# EAGLE design AGCON (EAGLE 6.5.0)
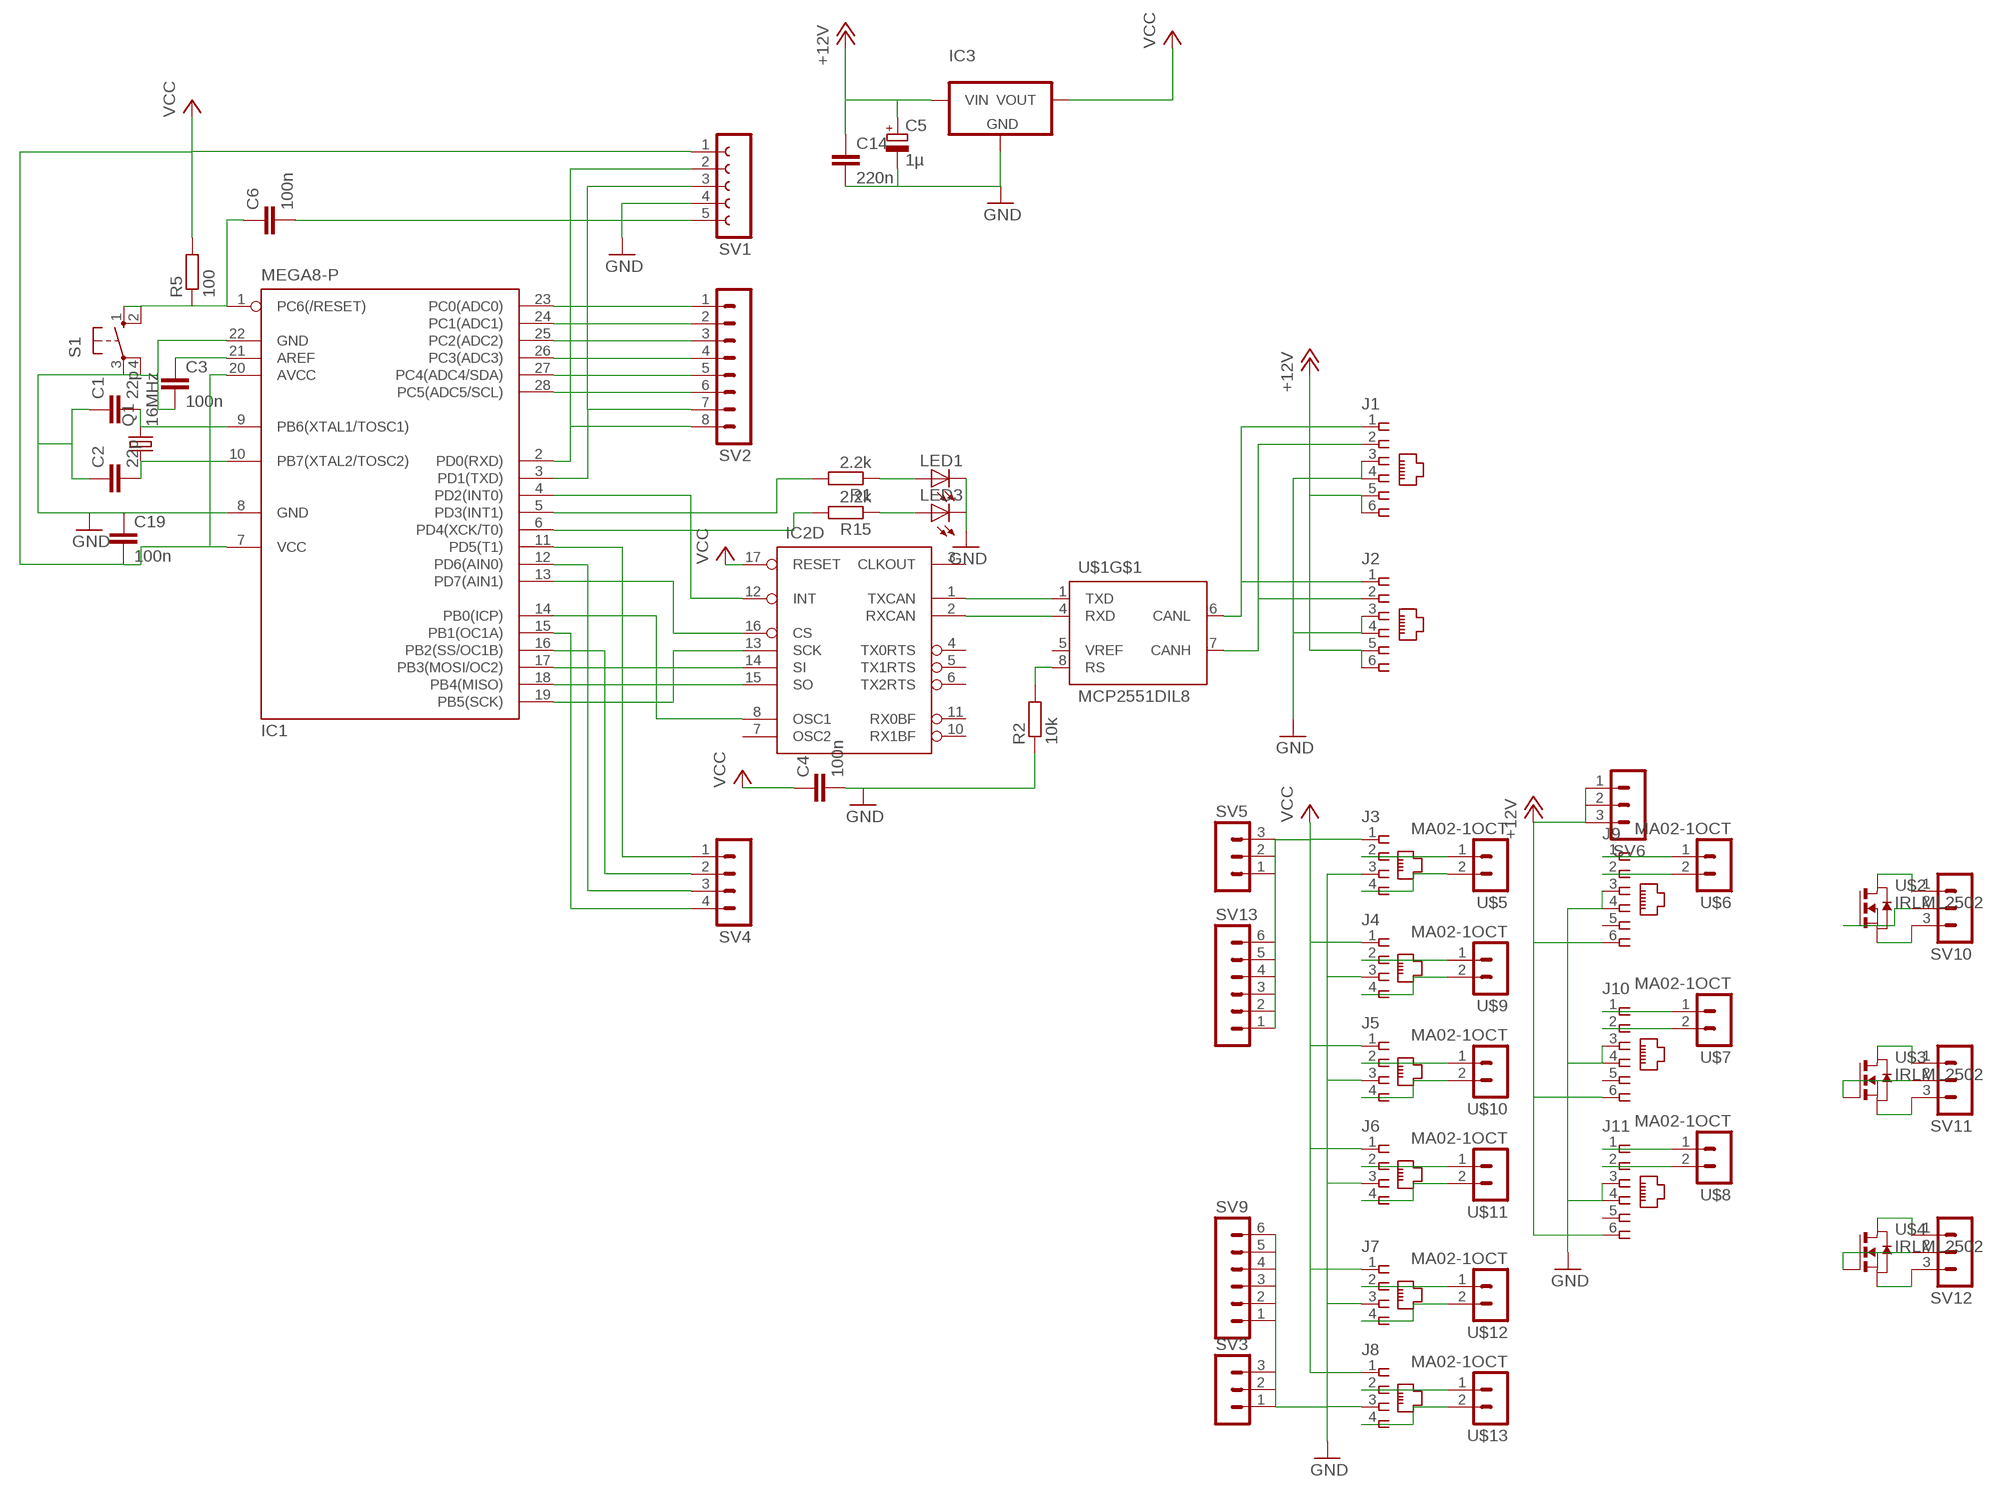
[diagram p0: schematic, sheet 1]

## Parts
C1  22p  C-EU025-024X044  [C025-024X044]
C2  22p  C-EU025-024X044  [C025-024X044]
C3  100n  C-EU050-024X044  [C050-024X044]
C4  100n  C-EU050-024X044  [C050-024X044]
C5  1µ  CPOL-EUE5-10.5  [E5-10,5]
C6  100n  C-EU050-024X044  [C050-024X044]
C14  220n  C-EU050-024X044  [C050-024X044]
C19  100n  C-EU050-024X044  [C050-024X044]
IC1  MEGA8-P  [DIL28-3]
IC2  MCP2515P  [DIL18]
IC3  MCP1702  [TO-92]
J1  520250-3  [520250-3]
J2  520250-3  [520250-3]
J3  520249-2  [520249-2]
J4  520249-2  [520249-2]
J5  520249-2  [520249-2]
J6  520249-2  [520249-2]
J7  520249-2  [520249-2]
J8  520249-2  [520249-2]
J9  520250-3  [520250-3]
J10  520250-3  [520250-3]
J11  520250-3  [520250-3]
LED1  LED3MM  [LED3MM]
LED3  LED3MM  [LED3MM]
Q1  16MHz  CRYSTALHC18U-V  [HC18U-V]
R1  2.2k  R-EU_0207/7  [0207/7]
R2  10k  R-EU_0207/7  [0207/7]
R5  100  R-EU_0207/7  [0207/7]
R15  2.2k  R-EU_0207/7  [0207/7]
S1  10-XX  [B3F-10XX]
SV1  FE05-1  [FE05-1]
SV2  MA08-1OCT  [MA08-1OCT]
SV3  MA03-1OCT  [MA03-1OCT]
SV4  MA04-1OCT  [MA04-1OCT]
SV5  MA03-1OCT  [MA03-1OCT]
SV6  MA03-1OCT  [MA03-1OCT]
SV9  MA06-1MA06-1OCT  [MA06-1OCT]
SV10  MA03-1OCT  [MA03-1OCT]
SV11  MA03-1OCT  [MA03-1OCT]
SV12  MA03-1OCT  [MA03-1OCT]
SV13  MA06-1MA06-1OCT  [MA06-1OCT]
U$1  MCP2551DIL8  [DIL08]
U$2  IRLML2502  [SOT-23]
U$3  IRLML2502  [SOT-23]
U$4  IRLML2502  [SOT-23]
U$5  MA02-1OCT  [MA02-1OCT]
U$6  MA02-1OCT  [MA02-1OCT]
U$7  MA02-1OCT  [MA02-1OCT]
U$8  MA02-1OCT  [MA02-1OCT]
U$9  MA02-1OCT  [MA02-1OCT]
U$10  MA02-1OCT  [MA02-1OCT]
U$11  MA02-1OCT  [MA02-1OCT]
U$12  MA02-1OCT  [MA02-1OCT]
U$13  MA02-1OCT  [MA02-1OCT]

## Nets
+12V: C5.+ C14.1 IC3.2(VIN) J1.5 J1.6 J2.5 J2.6 J9.6 J10.6 J11.6 SV6.1 SV6.2 SV6.3
GND: C1.1 C2.1 C3.2 C4.2 C5.- C14.2 C19.1 IC1.8(GND) IC1.22(GND) IC3.1(GND) J1.3 J1.4 J2.3 J2.4 J3.3 J4.3 J5.3 J6.3 J7.3 J8.3 J9.3 J9.4 J10.3 J10.4 J11.3 J11.4 LED1.K(C) LED3.K(C) R2.1 S1.3(P) S1.4(P1) SV1.4 SV3.1 SV3.2 SV3.3 SV9.1 SV9.2 SV9.3 SV9.4 SV9.5 SV9.6
N$1: IC1.18(PB4(MISO)) IC2.15(D:SO)
N$2: IC1.17(PB3(MOSI/OC2)) IC2.14(D:SI)
N$3: IC1.19(PB5(SCK)) IC2.13(D:SCK)
N$4: IC2.1(D:TXCAN) U$1.1(TXD)
N$5: IC2.2(D:RXCAN) U$1.4(RXD)
N$6: J1.1 J2.1 U$1.6(CANL)
N$7: J1.2 J2.2 U$1.7(CANH)
N$8: IC1.6(PD4(XCK/T0)) R15.2
N$9: C6.1 IC1.1(PC6(/RESET)) R5.1 S1.1(S) S1.2(S1)
N$10: LED1.A R1.1
N$11: C6.2 SV1.5
N$12: LED3.A R15.1
N$13: IC1.5(PD3(INT1)) R1.2
N$14: IC1.14(PB0(ICP)) IC2.8(D:OSC1)
N$15: R2.2 U$1.8(RS)
N$16: IC1.3(PD1(TXD)) SV1.3 SV2.7
N$17: IC1.2(PD0(RXD)) SV1.2 SV2.8
N$18: IC1.4(PD2(INT0)) IC2.12(D:INT)
N$19: IC1.13(PD7(AIN1)) IC2.16(D:CS)
N$20: C3.1 IC1.21(AREF)
N$21: IC1.23(PC0(ADC0)) SV2.1
N$22: C1.2 IC1.9(PB6(XTAL1/TOSC1)) Q1.2
N$23: C2.2 IC1.10(PB7(XTAL2/TOSC2)) Q1.1
N$24: IC1.24(PC1(ADC1)) SV2.2
N$25: IC1.25(PC2(ADC2)) SV2.3
N$26: IC1.26(PC3(ADC3)) SV2.4
N$27: IC1.27(PC4(ADC4/SDA)) SV2.5
N$28: IC1.28(PC5(ADC5/SCL)) SV2.6
N$29: J4.2 U$9.1
N$30: J5.2 U$10.1
N$31: IC1.11(PD5(T1)) SV4.1
N$32: IC1.12(PD6(AIN0)) SV4.3
N$33: IC1.15(PB1(OC1A)) SV4.4
N$34: IC1.16(PB2(SS/OC1B)) SV4.2
N$47: J6.2 U$11.1
N$48: J9.1 U$6.1
N$49: J9.2 U$6.2
N$50: J10.1 U$7.1
N$51: J3.2 U$5.1
N$52: J3.4 U$5.2
N$53: J10.2 U$7.2
N$54: J4.4 U$9.2
N$55: J11.1 U$8.1
N$56: J5.4 U$10.2
N$57: J11.2 U$8.2
N$58: J6.4 U$11.2
N$59: J7.2 U$12.1
N$60: J7.4 U$12.2
N$61: J8.2 U$13.1
N$62: J8.4 U$13.2
N$63: SV10.1 U$2.3(D)
N$64: SV10.2 U$2.1(G)
N$65: SV10.3 U$2.2(S)
N$66: SV11.1 U$3.3(D)
N$67: SV11.2 U$3.1(G)
N$68: SV11.3 U$3.2(S)
N$69: SV12.1 U$4.3(D)
N$70: SV12.2 U$4.1(G)
N$71: SV12.3 U$4.2(S)
VCC: C4.1 C19.2 IC1.7(VCC) IC1.20(AVCC) IC2.17(D:RESET) IC3.3(VOUT) J3.1 J4.1 J5.1 J6.1 J7.1 J8.1 R5.2 SV1.1 SV5.1 SV5.2 SV5.3 SV13.1 SV13.2 SV13.3 SV13.4 SV13.5 SV13.6
Unconnected: IC2.3(D:CLKOUT) IC2.4(D:TX0RTS) IC2.5(D:TX1RTS) IC2.6(D:TX2RTS) IC2.7(D:OSC2) IC2.10(D:RX1BF) IC2.11(D:RX0BF) J9.5 J10.5 J11.5 U$1.5(VREF)

## Power pins joined to a net without a drawn wire
GND: IC2.9(P:GND) U$1.2(GND)
VCC: IC2.18(P:VCC) U$1.3(VCC)

## Library data of the parts
C1 C2 = resistor:C-EU: CAPACITOR, European symbol
C3 C4 C6 C14 C19 = rcl:C-EU: CAPACITOR, European symbol
C5 = resistor:CPOL-EU: POLARIZED CAPACITOR, European symbol
IC1 = atmel:MEGA8-P: MICROCONTROLLER 8 Kbytes FLASH, 1 kbytes SRAM, 512 bytes EEPROM, USART, 4-channel 10 bit ADC, 2-channel 8 bit ADC Pin compatible with Atmega48, ATMega88, ATMega168 Source: avr.lbr; OC_FARNELL: unknown; OC_NEWARK: unknown
IC2 = can:MCP2515: MC2515 Stand-Alone CAN Controller With SPI Interface, Microchip
IC3 = SteveMarple:MCP1702: Microchip MCP1702 250mA loq quiescent current (2uA) LDO voltage regulator.
J1 J2 J9-J11 = con-amp:520250-3: AMP connector
J3-J8 = con-amp:520249-2: AMP connector
LED1 LED3 = led:LED: LED OSRAM: - CHIPLED LG R971, LG N971, LY N971, LG Q971, LY Q971, LO R971, LY R971 LH N974, LH R974 LS Q976, LO Q976, LY Q976 LO Q996 - Hyper CHIPLED LW Q18S LB Q993, LB Q99A, LB R99A - SideLED LS A670, LO A670, LY A670, LG A670, LP A670 LB A673, LV A673, LT A673, LW A673 LH A674 LY A675 LS A676, LA A676, LO A676, LY A676, LW A676 LS A679, LY A679, LG A679 - Hyper Micro SIDELED® LS Y876, LA Y876, LO Y876, LY Y876 LT Y87S - SmartLED LW L88C, LW L88S LB L89C, LB L89S, LG L890 LS L89K, LO L89K, LY L89K LS L896, LA L896, LO L896, LY L896 - TOPLED LS T670, LO T670, LY T670, LG T670, LP T670 LSG T670, LSP T670, LSY T670, LOP T670, LYG T670 LG T671, LOG T671, LSG T671 LB T673, LV T673, LT T673, LW T673 LH T674 LS T676, LA T676, LO T676, LY T676, LB T676, LH T676, LSB T676, LW T676 LB T67C, LV T67C, LT T67C, LS T67K, LO T67K, LY T67K, LW E67C LS E67B, LA E67B, LO E67B, LY E67B, LB E67C, LV E67C, LT E67C LW T67C LS T679, LY T679, LG T679 LS T770, LO T770, LY T770, LG T770, LP T770 LB T773, LV T773, LT T773, LW T773 LH T774 LS E675, LA E675, LY E675, LS T675 LS T776, LA T776, LO T776, LY T776, LB T776 LHGB T686 LT T68C, LB T68C - Hyper Mini TOPLED® LB M676 - Mini TOPLED Santana® LG M470 LS M47K, LO M47K, LY M47K Source: http://www.osram.convergy.de LUXEON: - LUMILED® LXK2-PW12-R00, LXK2-PW12-S00, LXK2-PW14-U00, LXK2-PW14-V00 LXK2-PM12-R00, LXK2-PM12-S00, LXK2-PM14-U00 LXK2-PE12-Q00, LXK2-PE12-R00, LXK2-PE12-S00, LXK2-PE14-T00, LXK2-PE14-U00 LXK2-PB12-K00, LXK2-PB12-L00, LXK2-PB12-M00, LXK2-PB14-N00, LXK2-PB14-P00, LXK2-PB14-Q00 LXK2-PR12-L00, LXK2-PR12-M00, LXK2-PR14-Q00, LXK2-PR14-R00 LXK2-PD12-Q00, LXK2-PD12-R00, LXK2-PD12-S00 LXK2-PH12-R00, LXK2-PH12-S00 LXK2-PL12-P00, LXK2-PL12-Q00, LXK2-PL12-R00 Source: www.luxeon.com KINGBRIGHT: KA-3528ASYC Source: www.kingbright.com
Q1 = crystal:CRYSTAL: CRYSTAL; OC_FARNELL: unknown; OC_NEWARK: unknown
R1 R2 R5 R15 = resistor:R-EU_: RESISTOR, European symbol
S1 = switch-omron:10-XX: OMRON SWITCH; MPN: B3F-1000; OC_FARNELL: 176432; OC_NEWARK: 36M3542
SV1 = con-lsta:FE05-1: FEMALE HEADER; OC_FARNELL: unknown; OC_NEWARK: unknown
SV2 = con-lstb:MA08-1: PIN HEADER
SV3 SV5 SV6 SV10-SV12 = con-lstb:MA03-1: PIN HEADER
SV4 = con-lstb:MA04-1: PIN HEADER
SV9 SV13 = con-lstb:MA06-1: PIN HEADER
U$1 = can:MCP2551: CAN Tranceiver Microchip
U$2-U$4 = IRLML2502:IRLML2502
U$5-U$13 = con-lstb:MA02-1

## Board
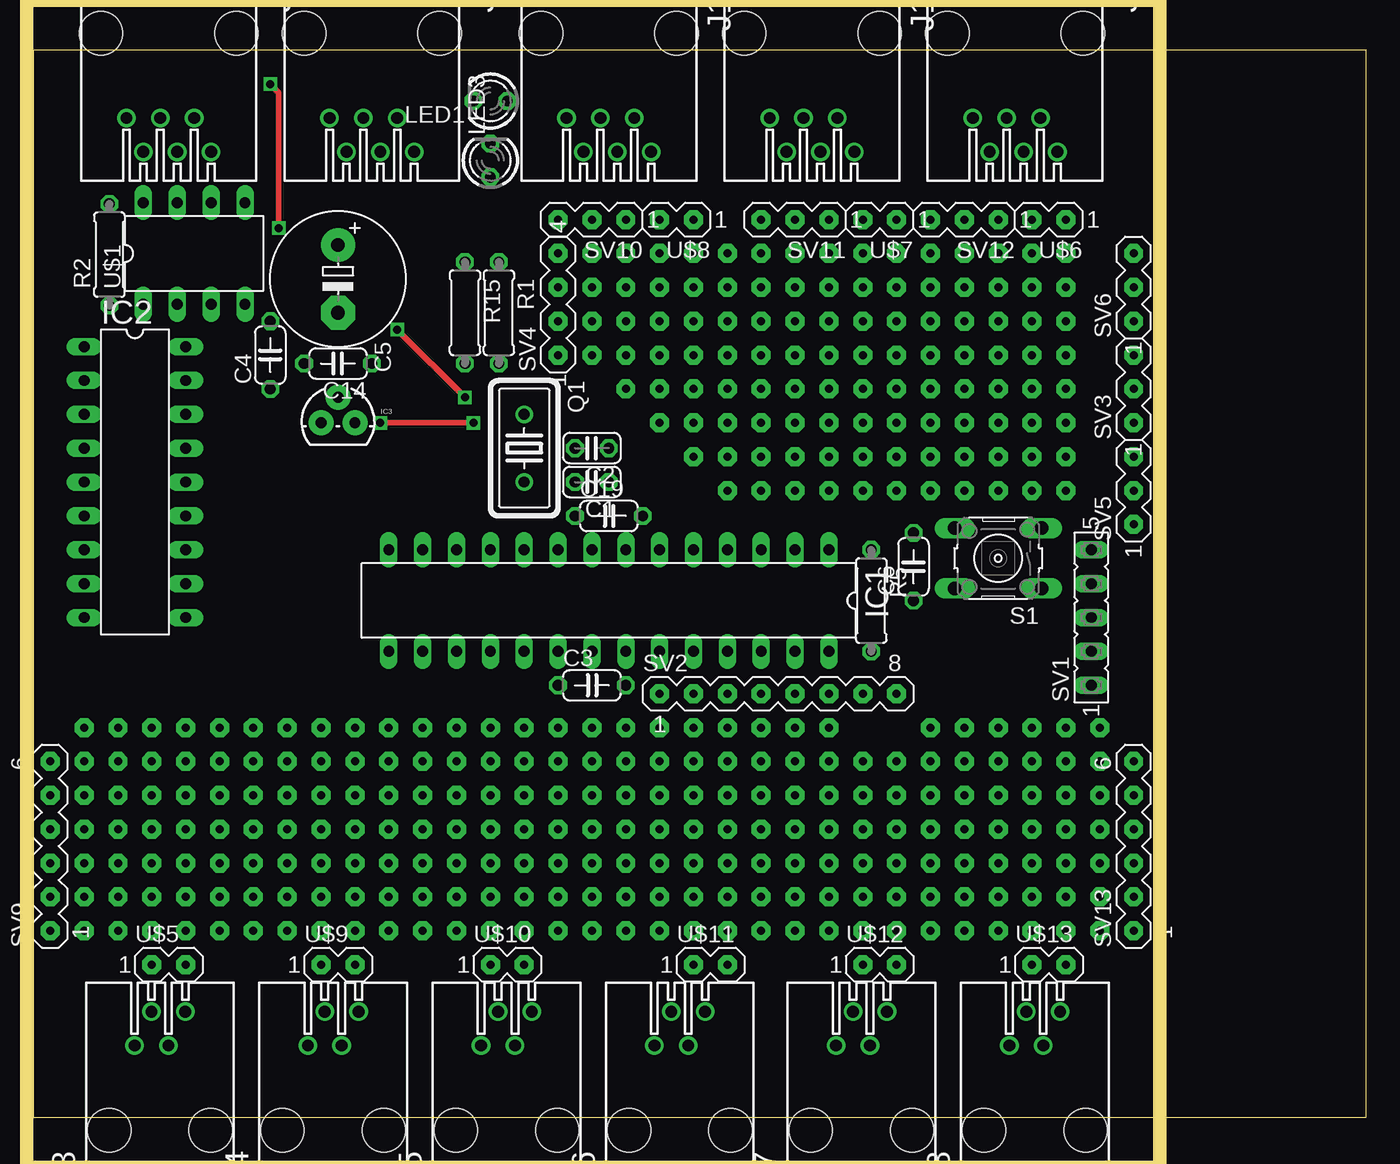
[diagram p1: board, top side]
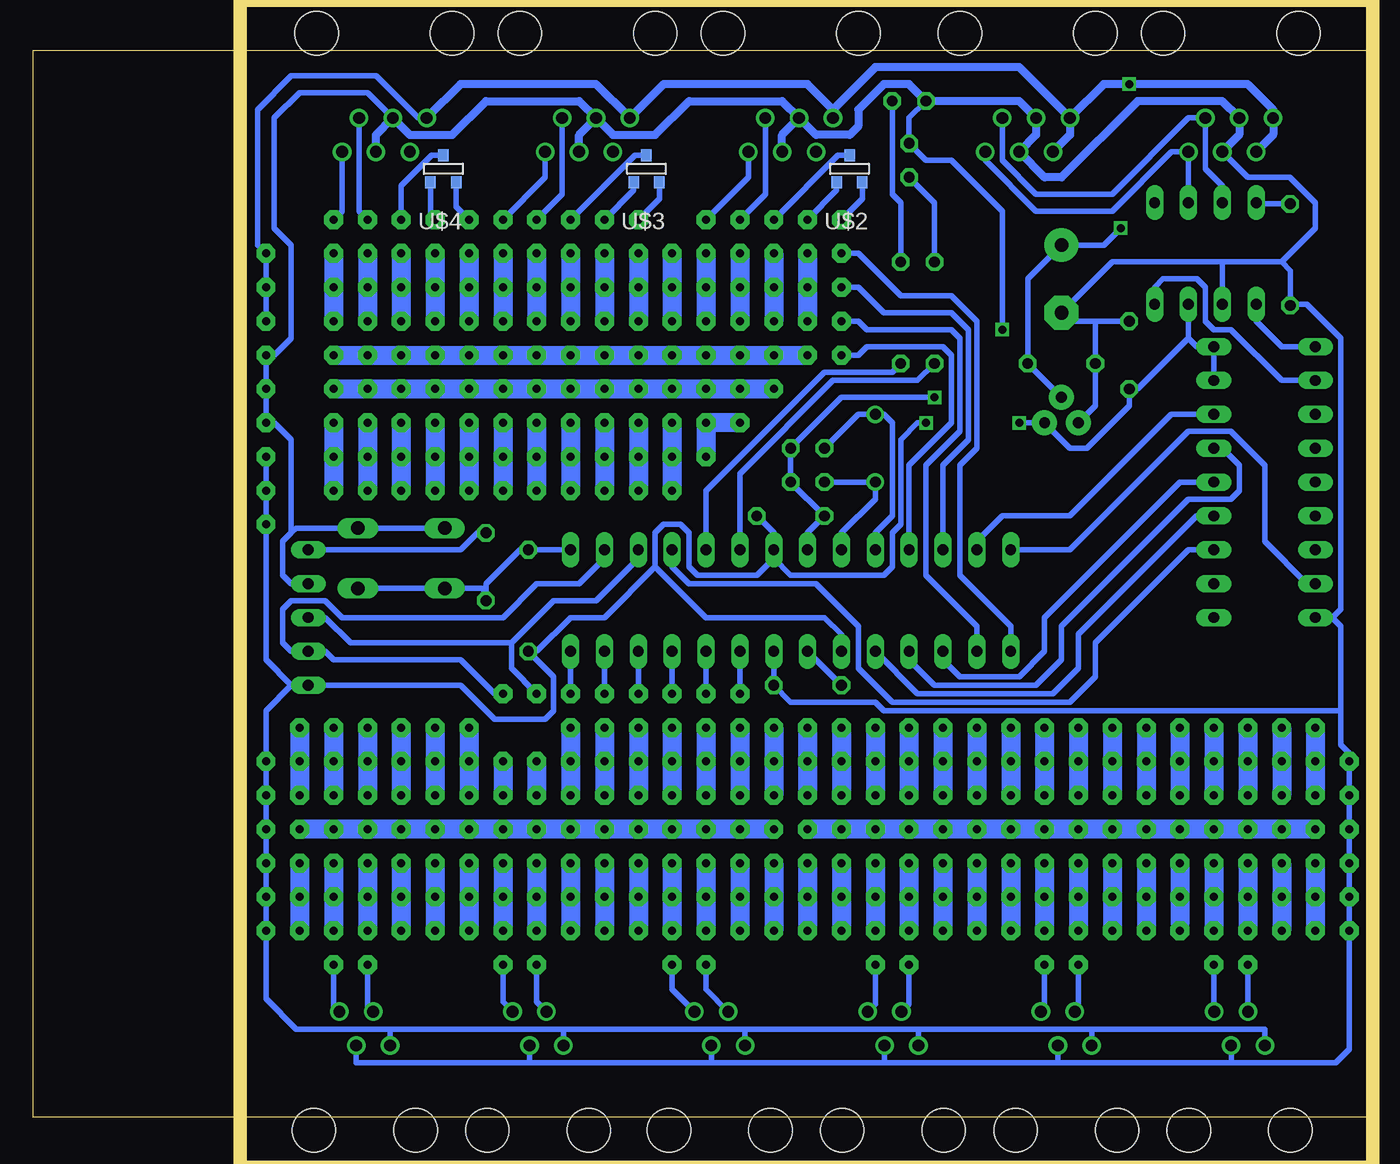
[diagram p2: board, bottom side, seen from below]

Size 100 x 80 mm. Coordinates in mm from the lower left corner, seen from the top.
Outline: 0,0 100,0 100,80 0,80 0,0
Copper layers (1*16): Top 0.035mm / dielectric 1.5mm / Bottom 0.035mm
Design rules "default *": minimum track width 10mil, minimum drill 23mil, track to track 9mil, track to pad 9mil, pad to pad 9mil, via to via 9mil, smd to smd 9mil, copper to edge 1mil, drill to drill 8mil, minimum pad ring 10mil, minimum via ring 8mil, stop-mask expansion 4mil, vias tented up to drill 0mil, thermal gap 10mil
Milling: 4 lines

### Footprints (pad centres in the part's own frame; a part is rotated, then mirrored left to right if it is on the bottom)
C025-024X044 = drill 0.813 octagon: 1 -1.27,0; 2 1.27,0
C050-024X044 = drill 0.813 octagon: 1 -2.54,0; 2 2.54,0
E5-10,5 = drill 1.016 pad 2.54: + -2.54,0 | drill 1.016 pad 2.54 octagon: - 2.54,0
DIL28-3 = drill 0.813 long: 1 -16.51,-3.81; 2 -13.97,-3.81; 3 -11.43,-3.81; 4 -8.89,-3.81; 5 -6.35,-3.81; 6 -3.81,-3.81; 7 -1.27,-3.81; 8 1.27,-3.81; 9 3.81,-3.81; 10 6.35,-3.81; 11 8.89,-3.81; 12 11.43,-3.81; 13 13.97,-3.81; 14 16.51,-3.81; 15 16.51,3.81; 16 13.97,3.81; 17 11.43,3.81; 18 8.89,3.81; 19 6.35,3.81; 20 3.81,3.81; 21 1.27,3.81; 22 -1.27,3.81; 23 -3.81,3.81; 24 -6.35,3.81; 25 -8.89,3.81; 26 -11.43,3.81; 27 -13.97,3.81; 28 -16.51,3.81
DIL18 = drill 0.813 long: 1 -10.16,-3.81; 2 -7.62,-3.81; 3 -5.08,-3.81; 4 -2.54,-3.81; 5 0,-3.81; 6 2.54,-3.81; 7 5.08,-3.81; 8 7.62,-3.81; 9 10.16,-3.81; 10 10.16,3.81; 11 7.62,3.81; 12 5.08,3.81; 13 2.54,3.81; 14 0,3.81; 15 -2.54,3.81; 16 -5.08,3.81; 17 -7.62,3.81; 18 -10.16,3.81
TO-92 = drill 0.813 pad 1.88: 1 -1.27,0; 2 0,1.905; 3 1.27,0
520250-3 = drill 0.889: 1 -3.175,8.89; 2 -1.905,6.35; 3 -0.635,8.89; 4 0.635,6.35; 5 1.905,8.89; 6 3.175,6.35 | hole 3.251: -5.08,0; 5.08,0
520249-2 = drill 0.889: 1 -1.905,6.35; 2 -0.635,8.89; 3 0.635,6.35; 4 1.905,8.89 | hole 3.251: -3.81,0; 3.81,0
LED3MM = drill 0.813 octagon: A -1.27,0; K 1.27,0
HC18U-V = drill 0.813: 1 -2.54,0; 2 2.54,0
0207/7 = drill 0.813 octagon: 1 -3.81,0; 2 3.81,0
B3F-10XX = drill 1.016 long: 1 -3.251,2.261; 2 3.251,2.261; 3 -3.251,-2.261; 4 3.251,-2.261
FE05-1 = drill 0.813 long: 1 -5.08,0; 2 -2.54,0; 3 0,0; 4 2.54,0; 5 5.08,0
MA08-1OCT = drill 0.6 pad 1.422 octagon: 1 -8.89,0; 2 -6.35,0; 3 -3.81,0; 4 -1.27,0; 5 1.27,0; 6 3.81,0; 7 6.35,0; 8 8.89,0
MA03-1OCT = drill 0.6 pad 1.422 octagon: 1 -2.54,0; 2 0,0; 3 2.54,0
MA04-1OCT = drill 0.6 pad 1.422 octagon: 1 -3.81,0; 2 -1.27,0; 3 1.27,0; 4 3.81,0
MA06-1OCT = drill 0.6 pad 1.422 octagon: 1 -6.35,0; 2 -3.81,0; 3 -1.27,0; 4 1.27,0; 5 3.81,0; 6 6.35,0
DIL08 = drill 0.813 long: 1 -3.81,-3.81; 2 -1.27,-3.81; 3 1.27,-3.81; 4 3.81,-3.81; 5 3.81,3.81; 6 1.27,3.81; 7 -1.27,3.81; 8 -3.81,3.81
SOT-23 = smd 0.787 x 0.889: 1 0.991,1.016; 2 -0.94,1.016; 3 0.025,-1.016
MA02-1OCT = drill 0.6 pad 1.422 octagon: 1 -1.27,0; 2 1.27,0

### Placement (x,y rotation side)
C1  41.91,47.62 180 top
C2  41.91,50.16 180 top
C3  41.91,32.38 0 top
C4  17.78,57.15 90 top
C5  22.86,62.87 270 top
C6  66.04,41.27 90 top
C14  22.86,56.52 180 top
C19  43.18,45.09 0 top
IC1  43.18,38.73 180 top
IC2  7.62,47.62 270 top
IC3  22.86,52.07 0 top
J1  10.16,81.28 180 top
J2  25.4,81.28 180 top
J3  9.5,-0.98 0 top
J4  22.5,-0.98 0 top
J5  35.5,-0.98 0 top
J6  48.5,-0.98 0 top
J7  62.13,-0.98 0 top
J8  75.14,-0.98 0 top
J9  73.66,81.28 180 top
J10  58.42,81.28 180 top
J11  43.18,81.28 180 top
LED1  34.29,76.2 180 top
LED3  34.29,71.75 90 top
Q1  36.83,50.16 270 top
R1  34.92,60.33 270 top
R2  5.71,64.68 90 top
R5  62.87,38.73 270 top
R15  32.38,60.33 270 top
S1  72.39,41.91 180 top
SV1  79.38,37.47 90 top
SV2  55.88,31.75 0 top
SV3  82.55,54.61 90 top
SV4  39.37,60.96 90 top
SV5  82.55,46.99 90 top
SV6  82.55,62.23 90 top
SV9  1.27,20.32 90 top
SV10  41.91,67.31 180 top
SV11  57.15,67.31 180 top
SV12  69.85,67.31 180 top
SV13  82.55,20.32 90 top
U$1  12.06,64.77 0 top
U$2  38.73,71.12 180 bottom
U$3  53.98,71.12 180 bottom
U$4  69.22,71.12 180 bottom
U$5  10.16,11.43 0 top
U$6  76.2,67.31 180 top
U$7  63.5,67.31 180 top
U$8  48.26,67.31 180 top
U$9  22.86,11.43 0 top
U$10  35.56,11.43 0 top
U$11  50.8,11.43 0 top
U$12  63.5,11.43 0 top
U$13  76.2,11.43 0 top

### Tracks (layer width: path | path; a pad name or v marks a point on that pad's centre or on a via)
+12V  (via drill 0.6)
  Top 0.406: v18.41,66.67 18.41,76.83 v17.78,77.47
  Bottom 0.406: v18.41,66.67 19.68,65.41 C5.+ 25.4,62.87 C14.1 IC3.2 | J9.6 71.12,74.93 74.3,78.11 80.64,78.11 83.19,75.56 83.19,65.41 SV6.3 SV6.2 SV6.1
  Bottom 0.61: J1.5 6.99,73.66 J1.6 6.99,75.56 8.89,77.47 v17.78,77.47 19.68,77.47 J2.6 | J2.6 22.23,73.66 J2.5 | J2.6 26.04,78.74 36.83,78.74 40.01,75.56 | J11.6 40.01,75.56 | 40.01,75.56 41.91,77.47 52.7,77.47 J10.6 57.78,77.47 67.94,77.47 J9.6
GND  (via drill 0.6)
  Top 0.406: v32.38,53.98 v27.3,59.05
  Bottom 0.406: 2.54,37.47 1.91,38.1 1.91,58.42 4.45,60.96 5.62,60.96 R2.1 5.71,63.49 6.35,64.14 | 2.54,37.47 IC2.9 | J1.3 8.89,70.48 5.71,70.48 3.81,68.58 3.81,66.67 6.35,64.14 | 10.79,64.14 19.05,64.14 C5.- 22.23,59.69 20.32,59.69 | 10.79,64.14 6.35,64.14 | C1.1 C2.1 39.37,53.98 v32.38,53.98 | S1.4 S1.3 80.29,44.17 80.64,43.81 | C4.2 20.32,59.69 | 49.13,4.06 62.77,4.06 | J7.3 62.77,4.06 | J6.3 49.13,4.06 | 49.13,4.06 36.13,4.06 | J5.3 36.13,4.06 | J4.3 23.14,4.06 | 23.14,4.06 36.13,4.06 | J8.3 75.77,4.06 62.77,4.06 | J3.3 10.13,4.06 | 10.13,4.06 23.14,4.06 | 1.91,30.48 1.91,27.94 1.27,27.3 SV9.6 SV9.5 SV9.4 SV9.3 SV9.2 SV9.1 1.27,5.08 2.29,4.06 10.13,4.06 | 1.91,30.48 1.91,36.83 2.54,37.47 | J9.4 74.93,76.83 80.01,76.83 81.92,74.93 81.92,66.67 80.64,65.41 80.64,58.42 81.92,57.15 SV3.3 SV3.2 SV3.1 81.92,52.07 80.64,50.8 80.64,43.81 | IC1.8 41.91,43.81 C19.1 C1.1 | C1.1 43.18,48.26 | IC3.1 20.32,53.34 C14.2 20.32,59.69 | v27.3,59.05 27.3,67.94 31.11,71.75 33.02,71.75 LED3.K 34.29,74.93 LED1.K | U$1.2 10.79,64.14 | SV1.4 80.64,40.01 81.28,40.64 81.28,43.18 80.64,43.81 | 1.91,30.48 36.2,30.48 36.83,31.11 43.18,31.11 C3.2 IC1.22
  Bottom 0.61: J1.3 9.53,73.66 J1.4 10.79,76.2 17.14,76.2 22.86,70.48 24.13,70.48 J2.3 24.77,73.66 J2.4 26.04,76.2 LED1.K 34.29,77.47 36.2,77.47 38.1,75.56 38.1,74.3 38.73,73.66 41.27,73.66 J11.4 | J11.3 43.81,73.66 J11.4 | J10.4 56.52,73.66 53.34,73.66 50.8,76.2 43.81,76.2 J11.4 | J10.3 59.05,73.66 J10.4 | J10.4 59.05,76.2 66.04,76.2 68.58,73.66 71.75,73.66 J9.4 74.3,73.66 J9.3
N$1
  Bottom 0.406: IC1.18 34.29,34.29 32.38,32.38 24.77,32.38 22.86,34.29 22.86,36.83 13.34,46.35 10.16,46.35 9.53,46.99 9.53,48.9 10.79,50.16 IC2.15
N$2
  Bottom 0.406: IC1.17 31.75,34.29 30.48,33.02 26.04,33.02 24.13,34.92 24.13,37.47 13.97,47.62 IC2.14
N$3
  Bottom 0.406: IC2.13 12.7,45.09 21.59,36.2 21.59,33.66 23.5,31.75 33.66,31.75 IC1.19
N$4
  Bottom 0.406: IC2.1 6.35,57.78 8.26,59.69 U$1.1
N$5
  Bottom 0.406: IC2.2 6.35,55.24 10.16,59.05 11.43,59.05 12.06,59.69 12.06,62.23 12.7,62.87 15.24,62.87 15.88,62.23 U$1.4
N$6
  Bottom 0.406: U$1.6 J1.1 14.61,72.39 19.05,67.94 24.77,67.94 28.57,71.75 J2.1
N$7
  Bottom 0.406: U$1.7 10.79,69.85 12.06,71.12 J1.2 13.34,74.93 19.05,69.22 24.77,69.22 27.3,71.75 J2.2
N$8
  Bottom 0.406: R15.2 33.66,55.24 40.01,55.24 46.99,48.26 IC1.6
N$9
  Bottom 0.406: IC1.1 R5.1 63.5,42.55 66.04,40.01 66.04,39.37 | S1.1 S1.2 66.32,39.65 66.04,39.37 | 66.04,39.37 C6.1
N$10
  Bottom 0.406: R1.1 34.92,68.58 35.56,69.22 LED1.A
N$11
  Bottom 0.406: C6.2 66.67,43.81 67.94,42.55 SV1.5
N$12
  Bottom 0.406: R15.1 32.38,68.58 LED3.A
N$13
  Bottom 0.406: R1.2 35.56,55.88 40.64,55.88 49.53,46.99 IC1.5
N$14
  Bottom 0.406: IC2.8 4.45,40.01 7.62,43.18 7.62,48.9 10.16,51.44 13.34,51.44 22.23,42.55 IC1.14
N$15
  Bottom 0.406: R2.2 8.16,68.49 U$1.8
N$16
  Bottom 0.406: IC1.3 54.61,41.91 57.78,38.73 60.96,38.73 64.14,35.56 | 64.14,35.56 64.14,33.66 SV2.7 | SV1.3 78.11,37.47 76.2,35.56 64.14,35.56
N$17
  Bottom 0.406: IC1.2 57.15,41.91 59.05,40.01 62.23,40.01 64.77,37.47 76.83,37.47 78.11,38.73 80.64,38.73 81.28,38.1 81.28,35.56 80.64,34.92 SV1.2 78.11,34.92 77.47,34.29 67.94,34.29 65.41,31.75 SV2.8
N$18
  Bottom 0.406: IC1.4 52.07,41.27 50.8,40.01 41.27,40.01 38.1,36.83 38.1,33.66 35.56,31.11 22.23,31.11 20.32,33.02 20.32,35.56 13.34,42.55 IC2.12
N$19
  Bottom 0.406: IC2.16 14.61,52.7 22.23,45.09 27.3,45.09 29.21,43.18 IC1.13
N$20
  Bottom 0.406: C3.1 IC1.21
N$21
  Bottom 0.406: IC1.23 SV2.1
N$22
  Bottom 0.406: IC1.9 39.37,43.81 36.83,46.35 Q1.2 C1.2
N$23
  Bottom 0.406: IC1.10 36.83,43.81 35.56,45.09 35.56,52.07 36.2,52.7 Q1.1 38.1,52.7 C2.2
N$24
  Bottom 0.406: IC1.24 SV2.2
N$25
  Bottom 0.406: IC1.25 SV2.3
N$26
  Bottom 0.406: IC1.26 SV2.4
N$27
  Bottom 0.406: IC1.27 SV2.5
N$28
  Bottom 0.406: IC1.28 SV2.6
N$29
  Bottom 0.406: U$9.1 21.59,8.18 J4.2
N$30
  Bottom 0.406: U$10.1 34.29,8.48 J5.2
N$31
  Bottom 0.406: IC1.11 34.29,48.9 31.11,52.07 31.11,57.15 31.75,57.78 37.47,57.78 38.1,57.15 SV4.1
N$32
  Bottom 0.406: IC1.12 31.75,48.9 29.84,50.8 29.84,59.05 31.11,60.33 36.2,60.33 38.1,62.23 SV4.3
N$33
  Bottom 0.406: SV4.4 38.1,64.77 34.92,61.59 31.11,61.59 29.21,59.69 29.21,50.16 30.48,48.9 30.48,40.64 26.67,36.83 IC1.15
N$34
  Bottom 0.406: IC1.16 29.21,36.83 33.02,40.64 33.02,48.9 30.48,51.44 30.48,58.42 31.11,59.05 37.47,59.05 38.1,59.69 SV4.2
N$35  (via drill 0.6 pad 1.42)
  Bottom 1.422: v62.23,64.77 62.23,59.69
N$36  (via drill 0.6 pad 1.42)
  other vias: 62.23,62.23
N$37  (via drill 0.6 pad 1.42)
  other vias: 62.23,59.69
N$38  (via drill 0.6 pad 1.42)
  Bottom 1.422: v57.15,64.77 57.15,59.69
N$39  (via drill 0.6 pad 1.42)
  other vias: 57.15,62.23
N$40  (via drill 0.6 pad 1.42)
  other vias: 57.15,59.69
N$41  (via drill 0.6 pad 1.42)
  Bottom 1.422: v59.69,64.77 59.69,59.69
N$42  (via drill 0.6 pad 1.42)
  other vias: 59.69,62.23
N$43  (via drill 0.6 pad 1.42)
  other vias: 59.69,59.69
N$44  (via drill 0.6 pad 1.42)
  Bottom 1.422: v64.77,64.77 64.77,59.69
N$45  (via drill 0.6 pad 1.42)
  other vias: 64.77,62.23
N$46  (via drill 0.6 pad 1.42)
  other vias: 64.77,59.69
N$47
  Bottom 0.406: U$11.1 49.53,9.57 J6.2
N$48
  Bottom 0.406: J9.1 76.83,67.94 U$6.1
N$49
  Bottom 0.406: J9.2 75.56,67.94 U$6.2
N$50
  Bottom 0.406: J10.1 61.59,70.48 U$7.1
N$51
  Bottom 0.406: U$5.1 8.89,7.93 J3.2
N$52
  Bottom 0.406: U$5.2 11.43,7.93 J3.4
N$53
  Bottom 0.406: J10.2 60.33,69.22 U$7.2
N$54
  Bottom 0.406: U$9.2 24.13,8.18 J4.4
N$55
  Bottom 0.406: J11.1 46.35,70.48 U$8.1
N$56
  Bottom 0.406: U$10.2 36.83,8.48 J5.4
N$57
  Bottom 0.406: J11.2 45.09,69.22 U$8.2
N$58
  Bottom 0.406: U$11.2 52.07,9.57 J6.4
N$59
  Bottom 0.406: U$12.1 62.23,8.63 J7.2
N$60
  Bottom 0.406: U$12.2 64.77,8.63 J7.4
N$61
  Bottom 0.406: U$13.1 74.93,8.34 J8.2
N$62
  Bottom 0.406: U$13.2 77.47,8.34 J8.4
N$63
  Bottom 0.406: U$2.3 39.62,72.14 SV10.1
N$64
  Bottom 0.406: U$2.1 39.73,69.49 SV10.2
N$65
  Bottom 0.406: U$2.2 37.8,68.89 SV10.3
N$66
  Bottom 0.406: U$3.3 54.86,72.14 SV11.1
N$67
  Bottom 0.406: U$3.1 54.97,69.49 SV11.2
N$68
  Bottom 0.406: U$3.2 53.03,68.89 SV11.3
N$69
  Bottom 0.406: U$4.3 70.1,72.14 72.39,69.85 SV12.1
N$70
  Bottom 0.406: U$4.1 70.21,67.67 SV12.2
N$71
  Bottom 0.406: U$4.2 68.28,68.28 SV12.3
N$72  (via drill 0.6 pad 1.42)
  Bottom 1.422: v54.61,64.77 54.61,59.69
N$73  (via drill 0.6 pad 1.42)
  other vias: 54.61,62.23
N$74  (via drill 0.6 pad 1.42)
  other vias: 54.61,59.69
N$75  (via drill 0.6 pad 1.42)
  Bottom 1.422: v52.07,64.77 52.07,59.69
N$76  (via drill 0.6 pad 1.42)
  other vias: 52.07,62.23
N$77  (via drill 0.6 pad 1.42)
  other vias: 52.07,59.69
N$78  (via drill 0.6 pad 1.42)
  Bottom 1.422: v49.53,64.77 49.53,59.69
N$79  (via drill 0.6 pad 1.42)
  other vias: 49.53,62.23
N$80  (via drill 0.6 pad 1.42)
  other vias: 49.53,59.69
N$81  (via drill 0.6 pad 1.42)
  Bottom 1.422: v46.99,64.77 46.99,59.69
N$82  (via drill 0.6 pad 1.42)
  other vias: 46.99,62.23
N$83  (via drill 0.6 pad 1.42)
  other vias: 46.99,59.69
N$84  (via drill 0.6 pad 1.42)
  Bottom 1.422: v44.45,64.77 44.45,59.69
N$85  (via drill 0.6 pad 1.42)
  other vias: 44.45,62.23
N$86  (via drill 0.6 pad 1.42)
  other vias: 44.45,59.69
N$87  (via drill 0.6 pad 1.42)
  Bottom 1.422: v41.91,64.77 41.91,59.69
N$88  (via drill 0.6 pad 1.42)
  other vias: 41.91,62.23
N$89  (via drill 0.6 pad 1.42)
  other vias: 41.91,59.69
N$90  (via drill 0.6 pad 1.42)
  Bottom 1.422: v67.31,64.77 67.31,59.69
N$91  (via drill 0.6 pad 1.42)
  other vias: 67.31,62.23
N$92  (via drill 0.6 pad 1.42)
  other vias: 67.31,59.69
N$93  (via drill 0.6 pad 1.42)
  Bottom 1.422: v69.85,64.77 69.85,59.69
N$94  (via drill 0.6 pad 1.42)
  other vias: 69.85,62.23
N$95  (via drill 0.6 pad 1.42)
  other vias: 69.85,59.69
N$96  (via drill 0.6 pad 1.42)
  Bottom 1.422: v72.39,64.77 72.39,59.69
N$97  (via drill 0.6 pad 1.42)
  other vias: 72.39,62.23
N$98  (via drill 0.6 pad 1.42)
  other vias: 72.39,59.69
N$99  (via drill 0.6 pad 1.42)
  Bottom 1.422: v74.93,64.77 74.93,59.69
N$100  (via drill 0.6 pad 1.42)
  other vias: 74.93,62.23
N$101  (via drill 0.6 pad 1.42)
  other vias: 74.93,59.69
N$102  (via drill 0.6 pad 1.42)
  Bottom 1.422: v77.47,64.77 77.47,59.69
N$103  (via drill 0.6 pad 1.42)
  other vias: 77.47,62.23
N$104  (via drill 0.6 pad 1.42)
  other vias: 77.47,59.69
N$105  (via drill 0.6 pad 1.42)
  Bottom 1.422: v77.47,57.15 41.91,57.15
N$106  (via drill 0.6 pad 1.42)
  Bottom 1.422: v77.47,54.61 44.45,54.61
N$107  (via drill 0.6 pad 1.42)
  Bottom 1.422: v77.47,52.07 77.47,46.99
N$108  (via drill 0.6 pad 1.42)
  other vias: 77.47,49.53
N$109  (via drill 0.6 pad 1.42)
  other vias: 77.47,46.99
N$110  (via drill 0.6 pad 1.42)
  other vias: 74.93,46.99
N$111  (via drill 0.6 pad 1.42)
  other vias: 74.93,49.53
N$112  (via drill 0.6 pad 1.42)
  Bottom 1.422: v74.93,52.07 74.93,46.99
N$113  (via drill 0.6 pad 1.42)
  other vias: 74.93,54.61
N$114  (via drill 0.6 pad 1.42)
  other vias: 74.93,57.15
N$115  (via drill 0.6 pad 1.42)
  other vias: 72.39,57.15
N$116  (via drill 0.6 pad 1.42)
  other vias: 72.39,54.61
N$117  (via drill 0.6 pad 1.42)
  Bottom 1.422: v72.39,52.07 72.39,46.99
N$118  (via drill 0.6 pad 1.42)
  other vias: 72.39,49.53
N$119  (via drill 0.6 pad 1.42)
  other vias: 72.39,46.99
N$120  (via drill 0.6 pad 1.42)
  other vias: 69.85,46.99
N$121  (via drill 0.6 pad 1.42)
  other vias: 69.85,49.53
N$122  (via drill 0.6 pad 1.42)
  Bottom 1.422: v69.85,52.07 69.85,46.99
N$123  (via drill 0.6 pad 1.42)
  other vias: 69.85,54.61
N$124  (via drill 0.6 pad 1.42)
  other vias: 69.85,57.15
N$125  (via drill 0.6 pad 1.42)
  other vias: 67.31,57.15
N$126  (via drill 0.6 pad 1.42)
  other vias: 67.31,54.61
N$127  (via drill 0.6 pad 1.42)
  Bottom 1.422: v67.31,52.07 67.31,46.99
N$128  (via drill 0.6 pad 1.42)
  other vias: 67.31,49.53
N$129  (via drill 0.6 pad 1.42)
  other vias: 67.31,46.99
N$130  (via drill 0.6 pad 1.42)
  other vias: 64.77,46.99
N$131  (via drill 0.6 pad 1.42)
  other vias: 64.77,49.53
N$132  (via drill 0.6 pad 1.42)
  Bottom 1.422: v64.77,52.07 64.77,46.99
N$133  (via drill 0.6 pad 1.42)
  other vias: 64.77,54.61
N$134  (via drill 0.6 pad 1.42)
  other vias: 64.77,57.15
N$135  (via drill 0.6 pad 1.42)
  other vias: 62.23,57.15
N$136  (via drill 0.6 pad 1.42)
  other vias: 62.23,54.61
N$137  (via drill 0.6 pad 1.42)
  Bottom 1.422: v62.23,52.07 62.23,46.99
N$138  (via drill 0.6 pad 1.42)
  other vias: 62.23,49.53
N$139  (via drill 0.6 pad 1.42)
  other vias: 62.23,46.99
N$140  (via drill 0.6 pad 1.42)
  other vias: 59.69,46.99
N$141  (via drill 0.6 pad 1.42)
  other vias: 59.69,49.53
N$142  (via drill 0.6 pad 1.42)
  Bottom 1.422: v59.69,52.07 59.69,46.99
N$143  (via drill 0.6 pad 1.42)
  other vias: 59.69,54.61
N$144  (via drill 0.6 pad 1.42)
  other vias: 59.69,57.15
N$145  (via drill 0.6 pad 1.42)
  other vias: 57.15,57.15
N$146  (via drill 0.6 pad 1.42)
  other vias: 57.15,54.61
N$147  (via drill 0.6 pad 1.42)
  Bottom 1.422: v57.15,52.07 57.15,46.99
N$148  (via drill 0.6 pad 1.42)
  other vias: 57.15,49.53
N$149  (via drill 0.6 pad 1.42)
  other vias: 57.15,46.99
N$150  (via drill 0.6 pad 1.42)
  other vias: 54.61,46.99
N$151  (via drill 0.6 pad 1.42)
  other vias: 54.61,49.53
N$152  (via drill 0.6 pad 1.42)
  Bottom 1.422: v54.61,52.07 54.61,46.99
N$153  (via drill 0.6 pad 1.42)
  other vias: 54.61,54.61
N$154  (via drill 0.6 pad 1.42)
  other vias: 54.61,57.15
N$155  (via drill 0.6 pad 1.42)
  other vias: 49.53,57.15
N$156  (via drill 0.6 pad 1.42)
  other vias: 52.07,57.15
N$157  (via drill 0.6 pad 1.42)
  other vias: 52.07,54.61
N$158  (via drill 0.6 pad 1.42)
  other vias: 49.53,54.61
N$159  (via drill 0.6 pad 1.42)
  other vias: 49.53,52.07
N$160  (via drill 0.6 pad 1.42)
  Bottom 1.422: v52.07,52.07 52.07,46.99
N$161  (via drill 0.6 pad 1.42)
  other vias: 52.07,49.53
N$162  (via drill 0.6 pad 1.42)
  other vias: 52.07,46.99
N$163  (via drill 0.6 pad 1.42)
  other vias: 46.99,57.15
N$164  (via drill 0.6 pad 1.42)
  other vias: 46.99,54.61
N$165  (via drill 0.6 pad 1.42)
  Bottom 1.422: v46.99,52.07 49.53,52.07 49.53,49.53
N$166  (via drill 0.6 pad 1.42)
  other vias: 49.53,49.53
N$167  (via drill 0.6 pad 1.42)
  other vias: 44.45,57.15
N$168  (via drill 0.6 pad 1.42)
  other vias: 44.45,54.61
N$169  (via drill 0.6 pad 1.42)
  other vias: 41.91,57.15
N$170  (via drill 0.6 pad 1.42)
  other vias: 77.47,13.97
N$171  (via drill 0.6 pad 1.42)
  other vias: 74.93,13.97
N$172  (via drill 0.6 pad 1.42)
  other vias: 72.39,13.97
N$173  (via drill 0.6 pad 1.42)
  other vias: 69.85,13.97
N$174  (via drill 0.6 pad 1.42)
  other vias: 67.31,13.97
N$175  (via drill 0.6 pad 1.42)
  other vias: 64.77,13.97
N$176  (via drill 0.6 pad 1.42)
  other vias: 62.23,13.97
N$177  (via drill 0.6 pad 1.42)
  other vias: 59.69,13.97
N$178  (via drill 0.6 pad 1.42)
  other vias: 57.15,13.97
N$179  (via drill 0.6 pad 1.42)
  other vias: 54.61,13.97
N$180  (via drill 0.6 pad 1.42)
  other vias: 52.07,13.97
N$181  (via drill 0.6 pad 1.42)
  other vias: 49.53,13.97
N$182  (via drill 0.6 pad 1.42)
  other vias: 46.99,13.97
N$183  (via drill 0.6 pad 1.42)
  other vias: 44.45,13.97
N$184  (via drill 0.6 pad 1.42)
  other vias: 41.91,13.97
N$185  (via drill 0.6 pad 1.42)
  other vias: 39.37,13.97
N$186  (via drill 0.6 pad 1.42)
  other vias: 36.83,13.97
N$187  (via drill 0.6 pad 1.42)
  other vias: 34.29,13.97
N$188  (via drill 0.6 pad 1.42)
  other vias: 31.75,13.97
N$189  (via drill 0.6 pad 1.42)
  other vias: 29.21,13.97
N$190  (via drill 0.6 pad 1.42)
  other vias: 26.67,13.97
N$191  (via drill 0.6 pad 1.42)
  other vias: 24.13,13.97
N$192  (via drill 0.6 pad 1.42)
  other vias: 21.59,13.97
N$193  (via drill 0.6 pad 1.42)
  other vias: 19.05,13.97
N$194  (via drill 0.6 pad 1.42)
  other vias: 16.51,13.97
N$195  (via drill 0.6 pad 1.42)
  other vias: 13.97,13.97
N$196  (via drill 0.6 pad 1.42)
  other vias: 11.43,13.97
N$197  (via drill 0.6 pad 1.42)
  other vias: 8.89,13.97
N$198  (via drill 0.6 pad 1.42)
  other vias: 6.35,13.97
N$199  (via drill 0.6 pad 1.42)
  other vias: 3.81,13.97
N$200  (via drill 0.6 pad 1.42)
  other vias: 6.35,24.13
N$201  (via drill 0.6 pad 1.42)
  other vias: 6.35,21.59
N$202  (via drill 0.6 pad 1.42)
  other vias: 80.01,13.97
N$203  (via drill 0.6 pad 1.42)
  other vias: 80.01,16.51
N$204  (via drill 0.6 pad 1.42)
  Bottom 1.422: v80.01,19.05 80.01,13.97
N$205  (via drill 0.6 pad 1.42)
  other vias: 80.01,21.59
N$206  (via drill 0.6 pad 1.42)
  other vias: 80.01,24.13
N$207  (via drill 0.6 pad 1.42)
  other vias: 80.01,26.67
N$208  (via drill 0.6 pad 1.42)
  other vias: 77.47,26.67
N$209  (via drill 0.6 pad 1.42)
  other vias: 74.93,26.67
N$210  (via drill 0.6 pad 1.42)
  other vias: 72.39,26.67
N$211  (via drill 0.6 pad 1.42)
  other vias: 69.85,26.67
N$212  (via drill 0.6 pad 1.42)
  other vias: 67.31,26.67
N$213  (via drill 0.6 pad 1.42)
  other vias: 67.31,24.13
N$214  (via drill 0.6 pad 1.42)
  other vias: 69.85,24.13
N$215  (via drill 0.6 pad 1.42)
  other vias: 72.39,24.13
N$216  (via drill 0.6 pad 1.42)
  other vias: 74.93,24.13
N$217  (via drill 0.6 pad 1.42)
  other vias: 77.47,24.13
N$218  (via drill 0.6 pad 1.42)
  other vias: 77.47,21.59
N$219  (via drill 0.6 pad 1.42)
  Bottom 1.422: v77.47,19.05 77.47,13.97
N$220  (via drill 0.6 pad 1.42)
  other vias: 77.47,16.51
N$221  (via drill 0.6 pad 1.42)
  other vias: 74.93,16.51
N$222  (via drill 0.6 pad 1.42)
  Bottom 1.422: v74.93,19.05 74.93,13.97
N$223  (via drill 0.6 pad 1.42)
  other vias: 74.93,21.59
N$224  (via drill 0.6 pad 1.42)
  other vias: 72.39,21.59
N$225  (via drill 0.6 pad 1.42)
  Bottom 1.422: v72.39,19.05 72.39,13.97
N$226  (via drill 0.6 pad 1.42)
  other vias: 72.39,16.51
N$227  (via drill 0.6 pad 1.42)
  other vias: 69.85,16.51
N$228  (via drill 0.6 pad 1.42)
  Bottom 1.422: v69.85,19.05 69.85,13.97
N$229  (via drill 0.6 pad 1.42)
  other vias: 69.85,21.59
N$230  (via drill 0.6 pad 1.42)
  other vias: 67.31,21.59
N$231  (via drill 0.6 pad 1.42)
  Bottom 1.422: v67.31,19.05 67.31,13.97
N$232  (via drill 0.6 pad 1.42)
  other vias: 67.31,16.51
N$233  (via drill 0.6 pad 1.42)
  other vias: 64.77,16.51
N$234  (via drill 0.6 pad 1.42)
  Bottom 1.422: v64.77,19.05 64.77,13.97
N$235  (via drill 0.6 pad 1.42)
  other vias: 64.77,21.59
N$236  (via drill 0.6 pad 1.42)
  other vias: 64.77,24.13
N$237  (via drill 0.6 pad 1.42)
  Bottom 1.422: v64.77,26.67 64.77,24.13
N$238  (via drill 0.6 pad 1.42)
  Bottom 1.422: v62.23,26.67 62.23,24.13
N$239  (via drill 0.6 pad 1.42)
  other vias: 59.69,26.67
N$240  (via drill 0.6 pad 1.42)
  other vias: 57.15,26.67
N$241  (via drill 0.6 pad 1.42)
  other vias: 54.61,26.67
N$242  (via drill 0.6 pad 1.42)
  other vias: 52.07,26.67
N$243  (via drill 0.6 pad 1.42)
  other vias: 49.53,26.67
N$244  (via drill 0.6 pad 1.42)
  other vias: 46.99,26.67
N$245  (via drill 0.6 pad 1.42)
  other vias: 44.45,26.67
N$246  (via drill 0.6 pad 1.42)
  other vias: 41.91,26.67
N$247  (via drill 0.6 pad 1.42)
  other vias: 39.37,26.67
N$248  (via drill 0.6 pad 1.42)
  other vias: 36.83,26.67
N$249  (via drill 0.6 pad 1.42)
  other vias: 34.29,26.67
N$250  (via drill 0.6 pad 1.42)
  other vias: 31.75,26.67
N$251  (via drill 0.6 pad 1.42)
  other vias: 29.21,26.67
N$252  (via drill 0.6 pad 1.42)
  other vias: 26.67,26.67
N$253  (via drill 0.6 pad 1.42)
  other vias: 24.13,26.67
N$254  (via drill 0.6 pad 1.42)
  other vias: 21.59,26.67
N$255  (via drill 0.6 pad 1.42)
  other vias: 19.05,26.67
N$256  (via drill 0.6 pad 1.42)
  other vias: 16.51,26.67
N$257  (via drill 0.6 pad 1.42)
  other vias: 62.23,24.13
N$258  (via drill 0.6 pad 1.42)
  other vias: 62.23,21.59
N$259  (via drill 0.6 pad 1.42)
  Bottom 1.422: v62.23,19.05 62.23,13.97
N$260  (via drill 0.6 pad 1.42)
  other vias: 62.23,16.51
N$261  (via drill 0.6 pad 1.42)
  other vias: 59.69,16.51
N$262  (via drill 0.6 pad 1.42)
  Bottom 1.422: v59.69,19.05 59.69,13.97
N$263  (via drill 0.6 pad 1.42)
  other vias: 59.69,21.59
N$264  (via drill 0.6 pad 1.42)
  other vias: 59.69,24.13
N$265  (via drill 0.6 pad 1.42)
  other vias: 57.15,24.13
N$266  (via drill 0.6 pad 1.42)
  other vias: 54.61,24.13
N$267  (via drill 0.6 pad 1.42)
  other vias: 52.07,24.13
N$268  (via drill 0.6 pad 1.42)
  other vias: 52.07,21.59
N$269  (via drill 0.6 pad 1.42)
  other vias: 54.61,21.59
N$270  (via drill 0.6 pad 1.42)
  other vias: 57.15,21.59
N$271  (via drill 0.6 pad 1.42)
  Bottom 1.422: v57.15,19.05 57.15,13.97
N$272  (via drill 0.6 pad 1.42)
  Bottom 1.422: v54.61,19.05 54.61,13.97
N$273  (via drill 0.6 pad 1.42)
  Bottom 1.422: v52.07,19.05 52.07,13.97
N$274  (via drill 0.6 pad 1.42)
  other vias: 52.07,16.51
N$275  (via drill 0.6 pad 1.42)
  other vias: 54.61,16.51
N$276  (via drill 0.6 pad 1.42)
  other vias: 57.15,16.51
N$277  (via drill 0.6 pad 1.42)
  other vias: 49.53,16.51
N$278  (via drill 0.6 pad 1.42)
  Bottom 1.422: v49.53,19.05 49.53,13.97
N$279  (via drill 0.6 pad 1.42)
  other vias: 49.53,21.59
N$280  (via drill 0.6 pad 1.42)
  other vias: 49.53,24.13
N$281  (via drill 0.6 pad 1.42)
  other vias: 46.99,24.13
N$282  (via drill 0.6 pad 1.42)
  other vias: 44.45,24.13
N$283  (via drill 0.6 pad 1.42)
  other vias: 41.91,24.13
N$284  (via drill 0.6 pad 1.42)
  other vias: 39.37,24.13
N$285  (via drill 0.6 pad 1.42)
  other vias: 36.83,24.13
N$286  (via drill 0.6 pad 1.42)
  other vias: 34.29,24.13
N$287  (via drill 0.6 pad 1.42)
  other vias: 31.75,24.13
N$288  (via drill 0.6 pad 1.42)
  other vias: 29.21,24.13
N$289  (via drill 0.6 pad 1.42)
  other vias: 29.21,21.59
N$290  (via drill 0.6 pad 1.42)
  other vias: 31.75,21.59
N$291  (via drill 0.6 pad 1.42)
  other vias: 34.29,21.59
N$292  (via drill 0.6 pad 1.42)
  other vias: 36.83,21.59
N$293  (via drill 0.6 pad 1.42)
  other vias: 39.37,21.59
N$294  (via drill 0.6 pad 1.42)
  other vias: 41.91,21.59
N$295  (via drill 0.6 pad 1.42)
  Bottom 1.422: v44.45,21.59 80.01,21.59
N$296  (via drill 0.6 pad 1.42)
  other vias: 46.99,21.59
N$297  (via drill 0.6 pad 1.42)
  Bottom 1.422: v46.99,19.05 46.99,13.97
N$298  (via drill 0.6 pad 1.42)
  other vias: 46.99,16.51
N$299  (via drill 0.6 pad 1.42)
  other vias: 44.45,16.51
N$300  (via drill 0.6 pad 1.42)
  Bottom 1.422: v44.45,19.05 44.45,13.97
N$301  (via drill 0.6 pad 1.42)
  Bottom 1.422: v41.91,19.05 41.91,13.97
N$302  (via drill 0.6 pad 1.42)
  other vias: 41.91,16.51
N$303  (via drill 0.6 pad 1.42)
  other vias: 39.37,16.51
N$304  (via drill 0.6 pad 1.42)
  Bottom 1.422: v39.37,19.05 39.37,13.97
N$305  (via drill 0.6 pad 1.42)
  Bottom 1.422: v36.83,19.05 36.83,13.97
N$306  (via drill 0.6 pad 1.42)
  other vias: 36.83,16.51
N$307  (via drill 0.6 pad 1.42)
  other vias: 34.29,16.51
N$308  (via drill 0.6 pad 1.42)
  Bottom 1.422: v34.29,19.05 34.29,13.97
N$309  (via drill 0.6 pad 1.42)
  Bottom 1.422: v31.75,19.05 31.75,13.97
N$310  (via drill 0.6 pad 1.42)
  other vias: 31.75,16.51
N$311  (via drill 0.6 pad 1.42)
  other vias: 29.21,16.51
N$312  (via drill 0.6 pad 1.42)
  Bottom 1.422: v29.21,19.05 29.21,13.97
N$313  (via drill 0.6 pad 1.42)
  other vias: 3.81,16.51
N$314  (via drill 0.6 pad 1.42)
  Bottom 1.422: v3.81,19.05 3.81,13.97
N$315  (via drill 0.6 pad 1.42)
  Bottom 1.422: v3.81,21.59 41.91,21.59
N$316  (via drill 0.6 pad 1.42)
  other vias: 3.81,24.13
N$317  (via drill 0.6 pad 1.42)
  other vias: 3.81,26.67
N$318  (via drill 0.6 pad 1.42)
  other vias: 6.35,26.67
N$319  (via drill 0.6 pad 1.42)
  Bottom 1.422: v6.35,19.05 6.35,13.97
N$320  (via drill 0.6 pad 1.42)
  other vias: 6.35,16.51
N$321  (via drill 0.6 pad 1.42)
  other vias: 8.89,16.51
N$322  (via drill 0.6 pad 1.42)
  Bottom 1.422: v8.89,19.05 8.89,13.97
N$323  (via drill 0.6 pad 1.42)
  other vias: 8.89,21.59
N$324  (via drill 0.6 pad 1.42)
  other vias: 8.89,24.13
N$325  (via drill 0.6 pad 1.42)
  other vias: 8.89,26.67
N$326  (via drill 0.6 pad 1.42)
  other vias: 11.43,26.67
N$327  (via drill 0.6 pad 1.42)
  other vias: 13.97,26.67
N$328  (via drill 0.6 pad 1.42)
  other vias: 13.97,24.13
N$329  (via drill 0.6 pad 1.42)
  other vias: 13.97,21.59
N$330  (via drill 0.6 pad 1.42)
  Bottom 1.422: v13.97,19.05 13.97,14.61
N$331  (via drill 0.6 pad 1.42)
  other vias: 13.97,16.51
N$332  (via drill 0.6 pad 1.42)
  other vias: 11.43,16.51
N$333  (via drill 0.6 pad 1.42)
  Bottom 1.422: v11.43,19.05 11.43,13.97
N$334  (via drill 0.6 pad 1.42)
  other vias: 11.43,21.59
N$335  (via drill 0.6 pad 1.42)
  other vias: 11.43,24.13
N$336  (via drill 0.6 pad 1.42)
  other vias: 16.51,24.13
N$337  (via drill 0.6 pad 1.42)
  other vias: 19.05,24.13
N$338  (via drill 0.6 pad 1.42)
  other vias: 21.59,24.13
N$339  (via drill 0.6 pad 1.42)
  other vias: 24.13,24.13
N$340  (via drill 0.6 pad 1.42)
  other vias: 26.67,24.13
N$341  (via drill 0.6 pad 1.42)
  other vias: 26.67,21.59
N$342  (via drill 0.6 pad 1.42)
  Bottom 1.422: v26.67,19.05 26.67,13.97
N$343  (via drill 0.6 pad 1.42)
  other vias: 26.67,16.51
N$344  (via drill 0.6 pad 1.42)
  other vias: 24.13,16.51
N$345  (via drill 0.6 pad 1.42)
  other vias: 21.59,16.51
N$346  (via drill 0.6 pad 1.42)
  other vias: 19.05,16.51
N$347  (via drill 0.6 pad 1.42)
  other vias: 16.51,16.51
N$348  (via drill 0.6 pad 1.42)
  Bottom 1.422: v16.51,19.05 16.51,13.97
N$349  (via drill 0.6 pad 1.42)
  other vias: 16.51,21.59
N$350  (via drill 0.6 pad 1.42)
  other vias: 19.05,21.59
N$351  (via drill 0.6 pad 1.42)
  other vias: 21.59,21.59
N$352  (via drill 0.6 pad 1.42)
  other vias: 24.13,21.59
N$353  (via drill 0.6 pad 1.42)
  Bottom 1.422: v24.13,19.05 24.13,13.97
N$354  (via drill 0.6 pad 1.42)
  Bottom 1.422: v21.59,19.05 21.59,13.97
N$355  (via drill 0.6 pad 1.42)
  Bottom 1.422: v19.05,19.05 19.05,13.97
N$356  (via drill 0.6 pad 1.42)
  Bottom 1.422: v3.81,29.21 3.81,24.13
N$357  (via drill 0.6 pad 1.42)
  Bottom 1.422: v6.35,29.21 6.35,24.13
N$358  (via drill 0.6 pad 1.42)
  Bottom 1.422: v8.89,29.21 8.89,24.13
N$359  (via drill 0.6 pad 1.42)
  Bottom 1.422: v11.43,29.21 11.43,24.13
N$360  (via drill 0.6 pad 1.42)
  Bottom 1.422: v13.97,29.21 13.97,24.13
N$361  (via drill 0.6 pad 1.42)
  Bottom 1.422: v16.51,29.21 16.51,24.13
N$362  (via drill 0.6 pad 1.42)
  Bottom 1.422: v19.05,29.21 19.05,24.13
N$363  (via drill 0.6 pad 1.42)
  Bottom 1.422: v21.59,29.21 21.59,24.13
N$364  (via drill 0.6 pad 1.42)
  Bottom 1.422: v24.13,29.21 24.13,24.13
N$365  (via drill 0.6 pad 1.42)
  Bottom 1.422: v26.67,29.21 26.67,24.13
N$366  (via drill 0.6 pad 1.42)
  Bottom 1.422: v29.21,29.21 29.21,24.13
N$367  (via drill 0.6 pad 1.42)
  Bottom 1.422: v31.75,29.21 31.75,24.13
N$368  (via drill 0.6 pad 1.42)
  Bottom 1.422: v34.29,29.21 34.29,24.13
N$369  (via drill 0.6 pad 1.42)
  Bottom 1.422: v36.83,29.21 36.83,24.13
N$370  (via drill 0.6 pad 1.42)
  Bottom 1.422: v39.37,29.21 39.37,24.13
N$371  (via drill 0.6 pad 1.42)
  Bottom 1.422: v41.91,29.21 41.91,24.13
N$372  (via drill 0.6 pad 1.42)
  Bottom 1.422: v44.45,29.21 44.45,24.13
N$373  (via drill 0.6 pad 1.42)
  Bottom 1.422: v46.99,29.21 46.99,24.13
N$374  (via drill 0.6 pad 1.42)
  Bottom 1.422: v49.53,29.21 49.53,24.13
N$375  (via drill 0.6 pad 1.42)
  Bottom 1.422: v52.07,29.21 52.07,24.13
N$376  (via drill 0.6 pad 1.42)
  Bottom 1.422: v54.61,29.21 54.61,24.13
N$377  (via drill 0.6 pad 1.42)
  Bottom 1.422: v57.15,29.21 57.15,24.13
N$378  (via drill 0.6 pad 1.42)
  Bottom 1.422: v59.69,29.21 59.69,24.13
N$379  (via drill 0.6 pad 1.42)
  Bottom 1.422: v67.31,29.21 67.31,24.13
N$380  (via drill 0.6 pad 1.42)
  Bottom 1.422: v69.85,29.21 69.85,24.13
N$381  (via drill 0.6 pad 1.42)
  Bottom 1.422: v72.39,29.21 72.39,24.13
N$382  (via drill 0.6 pad 1.42)
  Bottom 1.422: v74.93,29.21 74.93,24.13
N$383  (via drill 0.6 pad 1.42)
  Bottom 1.422: v77.47,29.21 77.47,24.13
N$384  (via drill 0.6 pad 1.42)
  Bottom 1.422: v80.01,29.21 80.01,24.13
VCC  (via drill 0.6)
  Top 0.406: v33.02,52.07 v26.04,52.07
  Bottom 0.406: 13.34,58.42 12.7,57.78 IC2.18 IC2.17 | 13.34,58.42 U$1.3 | 53.34,41.27 57.15,37.47 59.69,37.47 62.23,34.92 R5.2 60.96,33.02 60.96,30.48 61.59,29.84 65.41,29.84 67.94,32.38 SV1.1 80.64,32.38 | 53.34,41.27 53.34,43.81 52.7,44.45 51.44,44.45 50.8,43.81 50.8,41.27 50.16,40.64 45.72,40.64 44.45,41.91 | J8.1 73.23,6.6 | 73.23,6.6 80.26,6.6 82.55,8.89 SV13.1 SV13.2 SV13.3 SV13.4 SV13.5 SV13.6 82.55,30.48 80.64,32.38 | J7.1 60.23,6.6 | 60.23,6.6 73.23,6.6 | 33.59,6.6 46.59,6.6 | 46.59,6.6 60.23,6.6 | J6.1 46.59,6.6 | J3.1 7.59,6.6 20.59,6.6 | 20.59,6.6 33.59,6.6 | J5.1 33.59,6.6 | J4.1 20.59,6.6 | 53.34,41.27 49.53,37.47 40.64,37.47 39.37,36.2 IC1.20 | C19.2 44.45,43.81 IC1.7 44.45,41.91 | 44.45,41.91 43.18,40.64 36.2,40.64 35.56,41.27 35.56,43.81 34.92,44.45 34.92,50.8 33.66,52.07 v33.02,52.07 | v26.04,52.07 IC3.3 22.23,50.16 20.95,50.16 17.78,53.34 C4.1 17.14,54.61 13.34,58.42 | 80.64,32.38 82.55,34.29 SV5.1 SV5.2 SV5.3